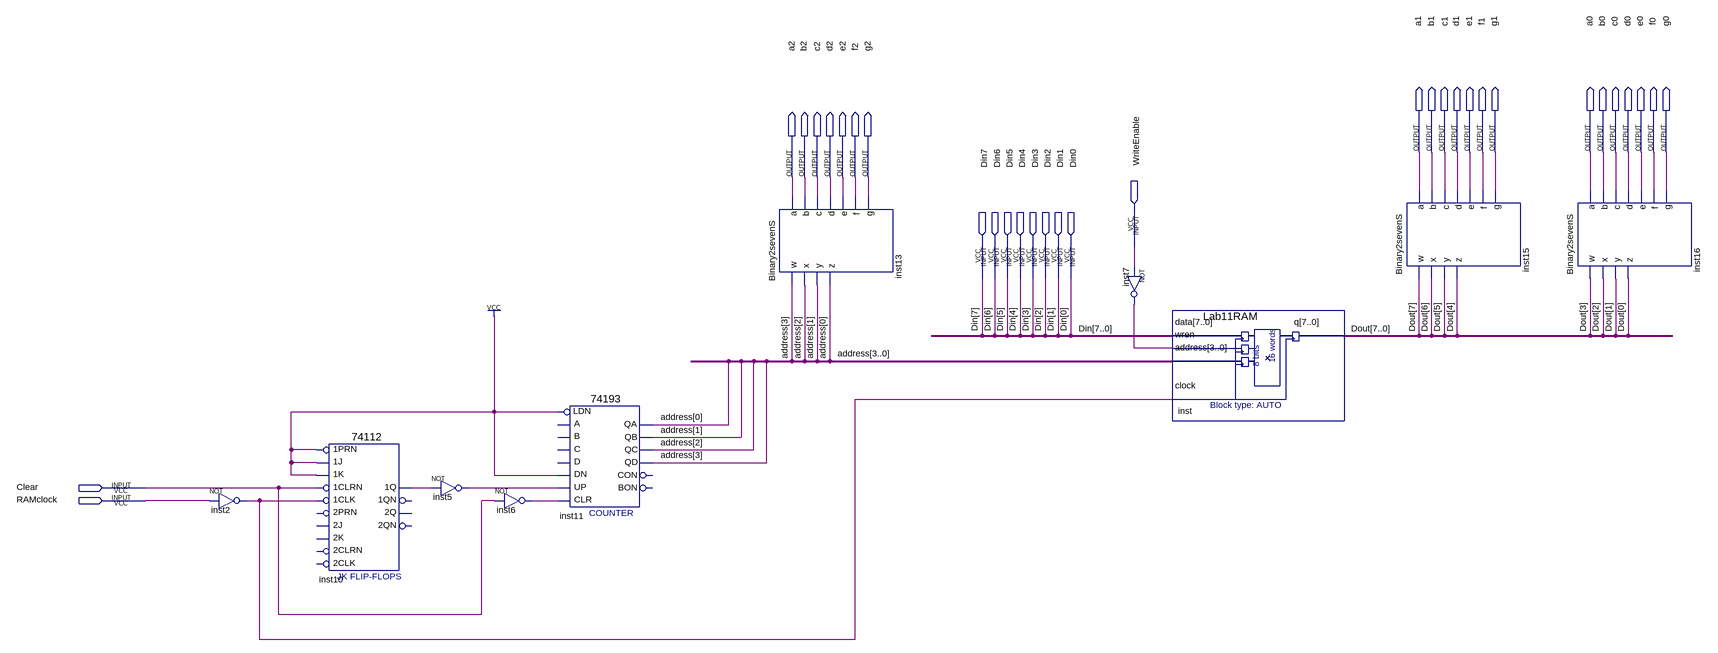
[diagram p0: schematic sheet]
// Quartus schematic Lab11_RAM_Tester.bdf as structural Verilog: 10 symbols, 32 pins
module Lab11_RAM_Tester (
  input  WriteEnable,
  input  Din7,
  input  Din6,
  input  Din5,
  input  Din4,
  input  Din3,
  input  Din2,
  input  Din1,
  input  Din0,
  input  Clear,
  input  RAMclock,
  output a1,
  output b1,
  output c1,
  output d1,
  output e1,
  output f1,
  output g1,
  output a0,
  output b0,
  output c0,
  output d0,
  output e0,
  output f0,
  output g0,
  output a2,
  output b2,
  output c2,
  output d2,
  output e2,
  output f2,
  output g2
);

  wire inst2_out, inst5_out, inst6_out, inst7_out, inst10_1q;
  wire [3:0] address;
  wire [7:0] Dout;

  not inst2 (inst2_out, RAMclock);
  \74112  inst10 (
    .\1K (1'b1), .\1J (1'b1), .\1PRN (1'b1), .\1CLK (inst2_out), .\1CLRN (Clear), .\1Q (inst10_1q));  // open: 2K, 2J, 2PRN, 2CLK, 2CLRN, 1QN, 2Q, 2QN
  not inst5 (inst5_out, inst10_1q);
  not inst6 (inst6_out, Clear);
  \74193  inst11 (
    .CLR(inst6_out), .UP(inst5_out), .DN(1'b1), .LDN(1'b1), .QB(address[1]), .QA(address[0]),
    .QD(address[3]), .QC(address[2]));  // open: D, C, B, A, CON, BON
  Binary2sevenS inst13 (
    .w(address[3]), .x(address[2]), .y(address[1]), .z(address[0]), .a(a2), .b(b2), .c(c2), .d(d2), .e(e2),
    .f(f2), .g(g2));
  not inst7 (inst7_out, WriteEnable);
  Lab11RAM inst (
    .data({Din7, Din6, Din5, Din4, Din3, Din2, Din1, Din0}), .wren(inst7_out), .address(address),
    .clock(inst2_out), .q(Dout));
  Binary2sevenS inst15 (
    .w(Dout[7]), .x(Dout[6]), .y(Dout[5]), .z(Dout[4]), .a(a1), .b(b1), .c(c1), .d(d1), .e(e1), .f(f1), .g(g1));
  Binary2sevenS inst16 (
    .w(Dout[3]), .x(Dout[2]), .y(Dout[1]), .z(Dout[0]), .a(a0), .b(b0), .c(c0), .d(d0), .e(e0), .f(f0), .g(g0));
endmodule
